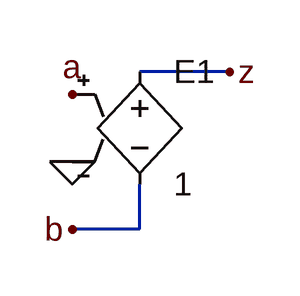
[diagram p0: schematic sum.asc]
sum.asc, the LTspice schematic file:
Version 4
SHEET 1 880 680
WIRE 304 112 240 112
WIRE 240 224 240 192
WIRE 240 224 192 224
FLAG 192 176 0
FLAG 192 128 a
FLAG 192 224 b
FLAG 304 112 z
SYMBOL e 240 96 R0
SYMATTR InstName E1
SYMATTR Value 1

The netlist it stands for:
* sum.asc
E1 z b a 0 1
.backanno
.end